# Altium project lab1_chernov_usb_i2c.PrjPcb
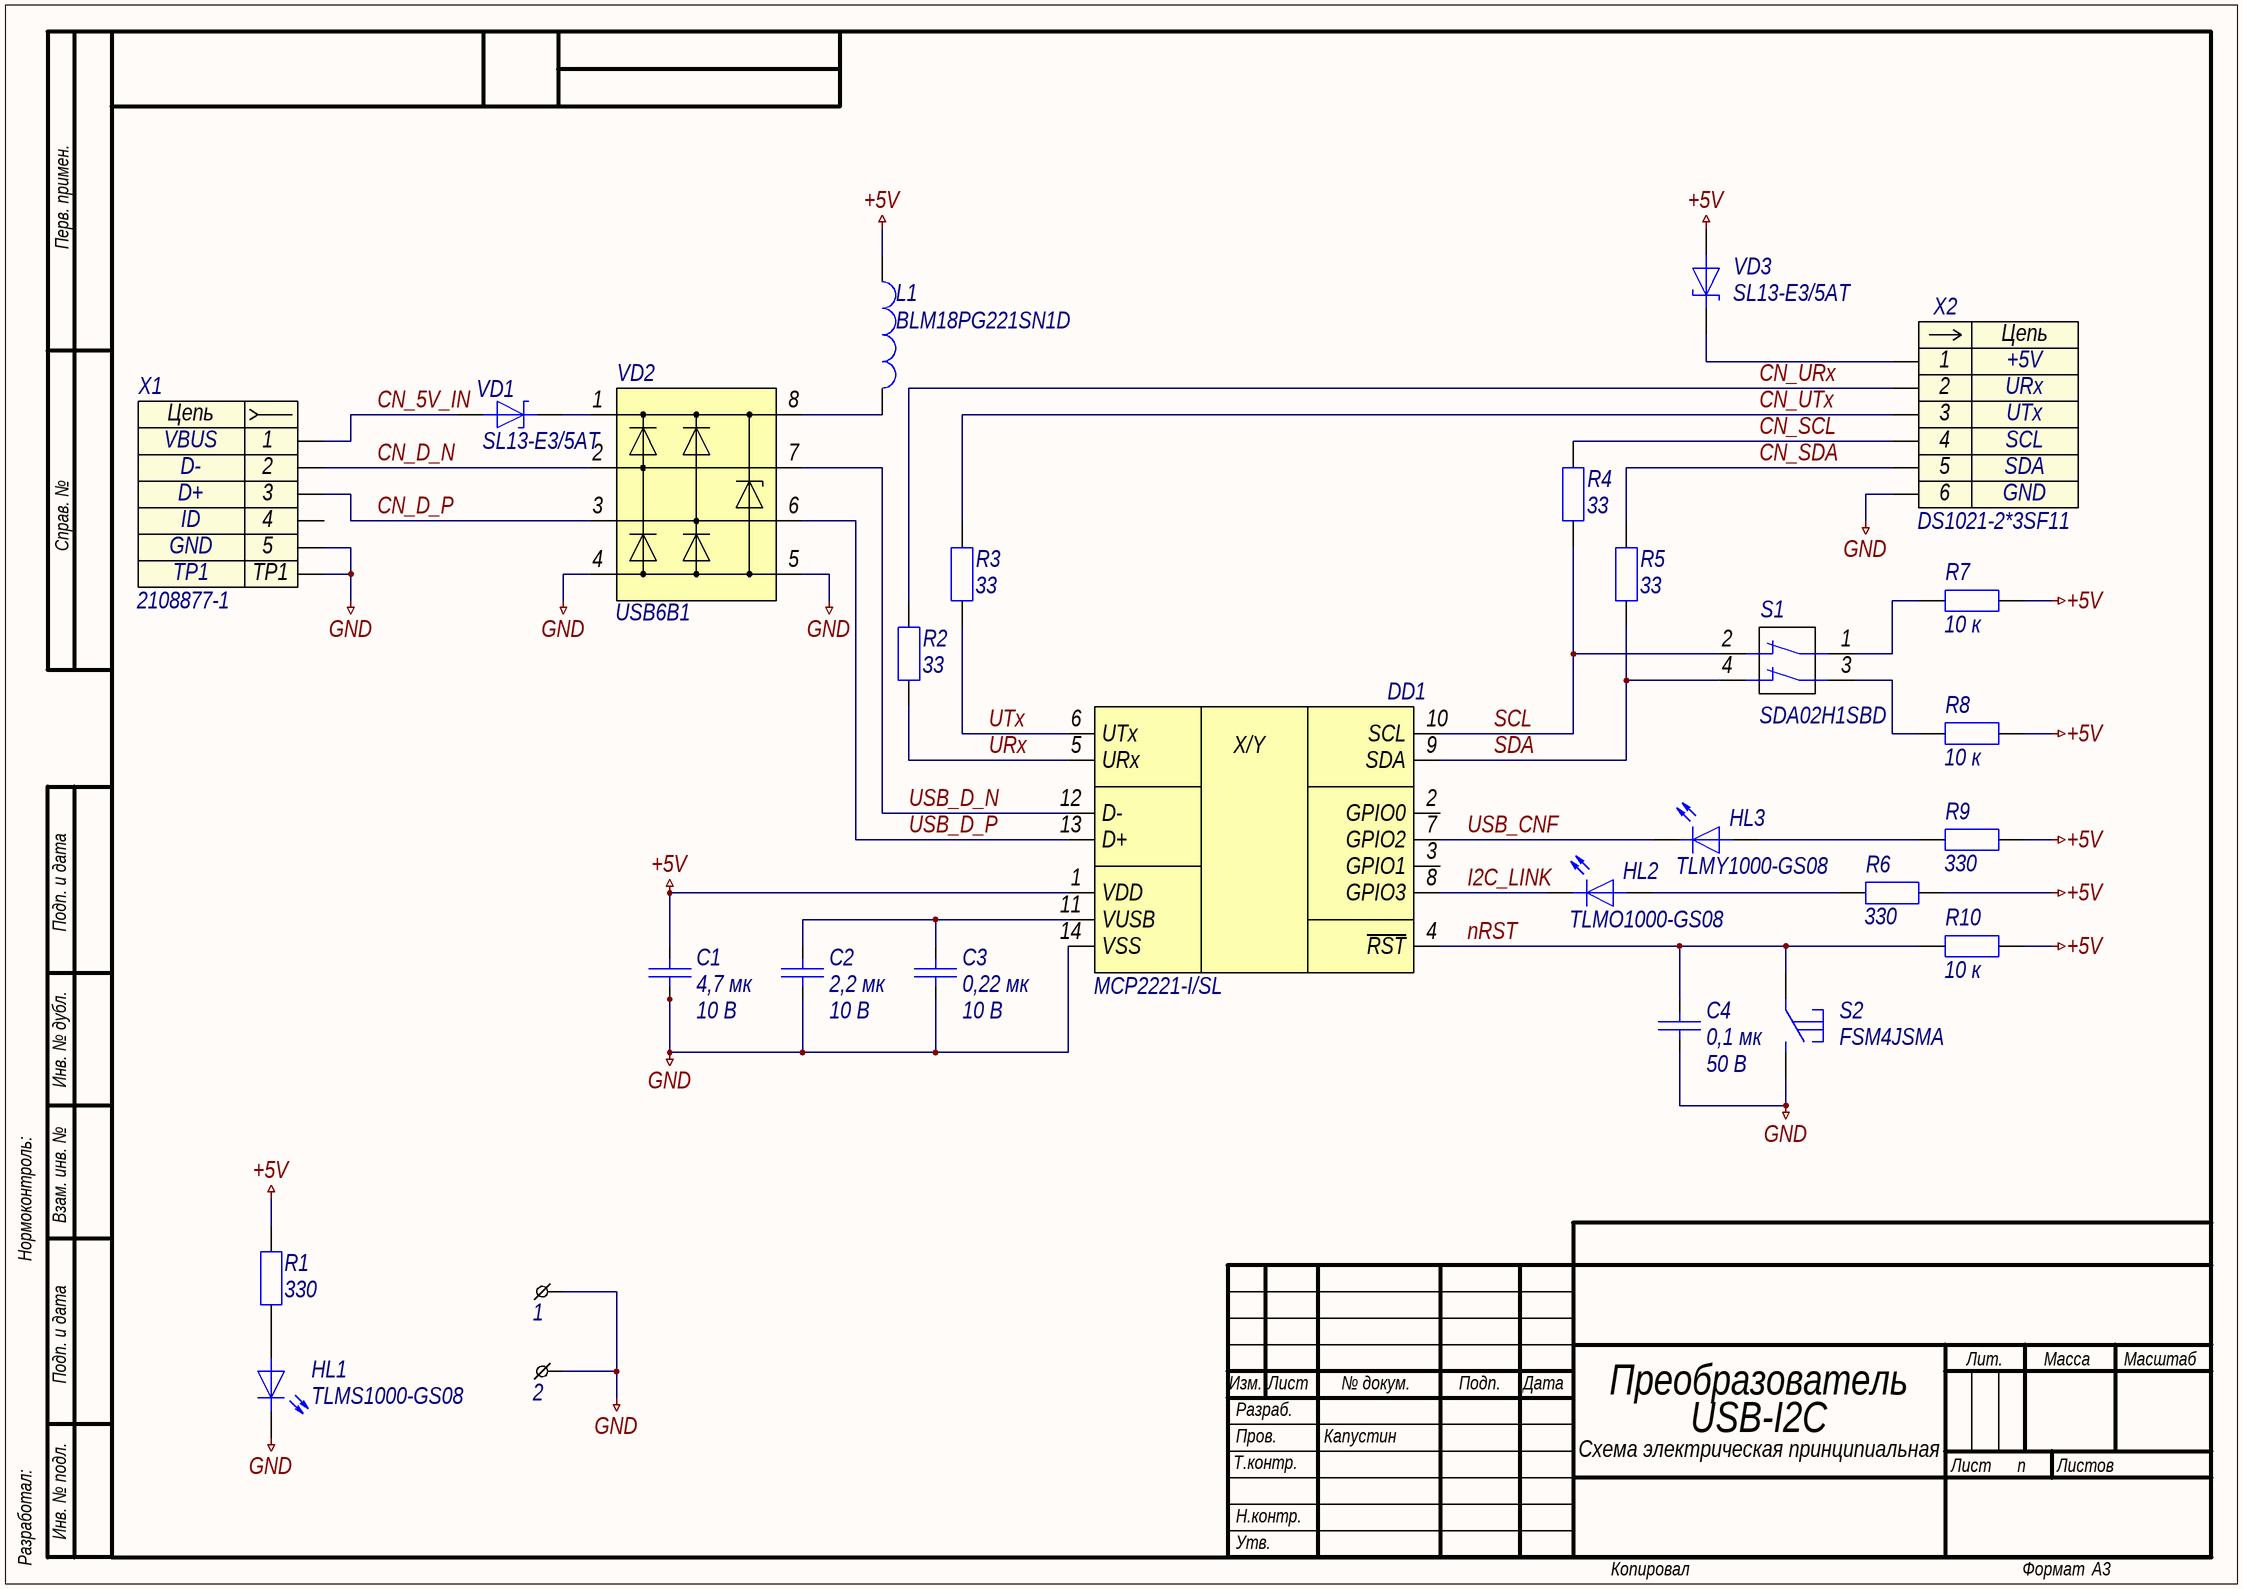
[diagram p0: lab1_chernov_usb_i2c.SchDoc]
approver: Капустин; check: Капустин; designation: СПБПУ.3331506.025; developer: Чернов; document_code: Ý3; document_type: Схема электрическая принципиальная; pcb_dec_number: СПБПУ.3331506.025; project: Лабораторная работа №1; title: Преобразователь USB-I2C; title_line_1: Преобразователь; title_line_2: USB-I2C
2 sheets, 28 parts. Net scope: global (net labels, ports and power ports of the same name join across sheets).
Board file: lab1_chernov_usb_i2c.PcbDoc
Sheets:
  lab1_chernov_usb_i2c.SchDoc
  usb_i2c_preferences.SchDoc

## Sheet lab1_chernov_usb_i2c.SchDoc: Преобразователь USB-I2C
size 420 x 297 mm; ApprovedBy: Капустин; CheckedBy: Капустин; DrawnBy: Чернов; DocumentNumber: СПБПУ.3331506.025Ý3; SheetNumber: n; DocumentCode: Ý3; ImagePath: СПБПУ.3331506.025

### Parts
1  MOUNTING_HOLE  [HOLE_1,6X3,3]  (value not drawn)
2  MOUNTING_HOLE  [HOLE_1,6X3,3]  (value not drawn)
C1  4,7 мк  Напряжение: 10 В  [C0603]
C2  2,2 мк  Напряжение: 10 В  [C0603]
C3  0,22 мк  Напряжение: 10 В  [C0603]
C4  0,1 мк  Напряжение: 50 В  [C0603]
DD1  MCP2221-I/SL  [SOIC127P600X175-14N]
HL1  TLMS1000-GS08  [HL0603]
HL2  TLMO1000-GS08  [HL0603]
HL3  TLMY1000-GS08  [HL0603]
L1  BLM18PG221SN1D  [BLM-2-0603]
R1  330  [R0603]
R2  33  [R0603]
R3  33  [R0603]
R4  33  [R0603]
R5  33  [R0603]
R6  330  [R0603]
R7  10 к  [R0603]
R8  10 к  [R0603]
R9  330  [R0603]
R10  10 к  [R0603]
S1  SDA02H1SBD  [DIP-SWITCH-02-706X930X545]
S2  FSM4JSMA  [FSM4JSMA]
VD1  SL13-E3/5AT  [DO-214AC]
VD2  USB6B1  [SO-8]
VD3  SL13-E3/5AT  [DO-214AC]
X1  2108877-1  [2108877-1]
X2  DS1021-2*3SF11  [DS1021-2X3SF11]

### Nets
+5V: C1.2 DD1.1(VDD) L1.1 R1.1 R6.2 R7.2 R8.2 R9.2 R10.2 VD3.2
GND: 1.1 2.1 C1.1 C2.1 C3.1 C4.1 DD1.14(VSS) HL1.1 S2.2 VD2.4 VD2.5 X1.5 X1.TP1 X2.6
CN_5V_IN: VD1.2 X1.1
CN_D_N: VD2.2 X1.2
CN_D_P: VD2.3 X1.3
CN_SCL: R4.1 X2.4
CN_SDA: R5.1 X2.5
CN_URx: R2.1 X2.2
CN_UTx: R3.1 X2.3
I2C_LINK: DD1.8(GPIO3) HL2.1
nRST: C4.2 DD1.4(~{RST}) R10.1 S2.1
SCL: DD1.10(SCL) R4.2 S1.2
SDA: DD1.9(SDA) R5.2 S1.4
URx: DD1.5(URx) R2.2
USB_CNF: DD1.7(GPIO2) HL3.1
USB_D_N: DD1.12(D-) VD2.7
USB_D_P: DD1.13(D+) VD2.6
UTx: DD1.6(UTx) R3.2
NetC2_2: C2.2 C3.2 DD1.11(VUSB)
NetHL1_2: HL1.2 R1.2
NetHL2_2: HL2.2 R6.1
NetHL3_2: HL3.2 R9.1
NetL1_2: L1.2 VD2.8
NetR7_1: R7.1 S1.1
NetR8_1: R8.1 S1.3
NetVD1_1: VD1.1 VD2.1
NetVD3_1: VD3.1 X2.1

Not connected (* = marked no-connect by the designer): DD1 2(GPIO0) 3(GPIO1); X1 4

### Notes on the sheet
- Перв. примен.
- Справ. №
- Подп. и дата
- Инв. № дубл.
- Нормоконтроль:
- Взам. инв. №
- Изм.
- Лист
- № докум.
- Подп.
- Дата
- Лит.
- Масса
- Масштаб
- Т.контр.
- Пров.
- Разраб.
- Листов
- Разработал:
- Инв. № подл.
- Н.контр.
- Утв.
- Копировал
- Формат
- А3
- (in symbol MCP2221-I/SL) X/Y
- (in symbol x0001) Цепь
- (in symbol x0003) Цепь

### Library data of the parts
1 2 = Отверстие 1,6x3,3: id: fstn0011; Описание: Отверстие под М1,5; Диаметр отверстия: 1,6 мм; Параметры металлизации: 3,3 мм; Наименование: Отверстие 1,6x3,3
C1 = c0012: =Описание; ID: c0012; Фамилия: Чернов; Описание: Конденсатор чип 0603 4,7 мкФ 10 В ±10 %; Наименование: CC0603KRX5R6BB475; Производитель: Yageo; Отклонение: ±10 %; Рабочие температуры: от -55 °С до +85 °С; Корпус: 0603; Номинал: 4,7 мк; Номинальное напряжение: 10 В; HelpURL: https://www.yageo.com/upload/media/product/productsearch/datasheet/mlcc/UPY-GPHC_X5R_4V-to-50V_26.pdf
C2 = c0009: =Описание; ID: c0009; Фамилия: Чернов; Описание: Конденсатор чип 0603 2,2 мкФ 10 В ±10 %; Наименование: CC0603KRX7R6BB225; Производитель: Yageo; Отклонение: ±10 %; Рабочие температуры: от -55 °С до +125 °С; Корпус: 0603; Номинал: 2,2 мк; Номинальное напряжение: 10 В; HelpURL: https://www.yageo.com/upload/media/product/productsearch/datasheet/mlcc/UPY-GPHC_X7R_6.3V-to-50V_20.pdf
C3 = c0006: =Описание; ID: c0006; Фамилия: Чернов; Описание: Конденсатор чип 0603 0,22 мкФ 10 В ±5 %; Наименование: CC0603JRX7R6BB224; Производитель: Yageo; Отклонение: ±5 %; Рабочие температуры: от -55 °С до +125 °С; Корпус: 0603; Номинал: 0,22 мк; Номинальное напряжение: 10 В; HelpURL: https://www.yageo.com/upload/media/product/productsearch/datasheet/mlcc/UPY-GPHC_X7R_6.3V-to-50V_20.pdf
C4 = c0005: =Описание; ID: c0005; Фамилия: Ларионов; Описание: Конденсатор чип 0603 0,1 мкФ 50 В ±5 %; Наименование: CC0603JRX7R9BB104; Производитель: Yageo; Отклонение: ±5 %; Рабочие температуры: от -55 °С до +125 °С; Корпус: 0603; Номинал: 0,1 мк; Номинальное напряжение: 50 В; HelpURL: https://www.yageo.com/upload/media/product/products/datasheet/mlcc/UPY-GPHC_X7R_6.3V-to-50V_20.pdf
HL1 = hl0001: =Описание; ID: hl0001; Фамилия: Ларионов; Описание: Светодиод чип 0603 красный; Производитель: Vishay Intertechnology, Inc.; Цвет: Red; Номинальная сила света: 4 мкд; Номинальная длина волны: 628 нм; Номинальный прямой ток: 15 мА; Номинальное падение напряжения: 1,8 В; Рассеиваемая мощность: 40 мВт; Рабочие температуры: от -40 °С до +100 °С; Корпус: 0603; Наименование: TLMS1000-GS08; HelpURL: https://www.vishay.com/leds/list/product-83172/
HL2 = hl0002: =Описание; ID: hl0002; Фамилия: Ларионов; Описание: Светодиод чип 0603 светло-оранжевый; Производитель: Vishay Intertechnology, Inc.; Цвет: Soft orange; Номинальная сила света: 7,5 мкд; Номинальная длина волны: 605 нм; Номинальный прямой ток: 15 мА; Номинальное падение напряжения: 1,8 В; Рассеиваемая мощность: 40 мВт; Рабочие температуры: от -40 °С до +100 °С; Корпус: 0603; Наименование: TLMO1000-GS08; HelpURL: https://www.vishay.com/leds/list/product-83172/
HL3 = hl0003: =Описание; ID: hl0003; Фамилия: Ларионов; Описание: Светодиод чип 0603 желтый; Производитель: Vishay Intertechnology, Inc.; Цвет: Yellow; Номинальная сила света: 7,5 мкд; Номинальная длина волны: 588 нм; Номинальный прямой ток: 15 мА; Номинальное падение напряжения: 1,8 В; Рассеиваемая мощность: 40 мВт; Рабочие температуры: от -40 °С до +100 °С; Корпус: 0603; Наименование: TLMY1000-GS08; HelpURL: https://www.vishay.com/leds/list/product-83172/
L1 = l0002: =Описание; ID: l0002; Фамилия: Самарин; Описание: Ферритовая бусина 220 Ом ±25 %; Производитель: Murata Manufacturing Co., Ltd.; Сопротивление, 100 МГц: 220 Ом; Отклонение, 100 Мгц: ±25 %; Сопротивление при постоянном токе: 0,1 Ом; Рабочие температуры: от -55 °С до +125 °С; Корпус: 0603; Наименование: BLM18PG221SN1D; HelpURL: https://www.murata.com/en-global/products/productdetail?partno=BLM18PG221SN1%23
R1 R6 R9 = r0009: =Описание; ID: r0009; Фамилия: Ларионов; Описание: Резистор чип 0603 330 Ом ±1 % 0,1 Вт; Наименование: RC0603FR-07330RL; Производитель: Yageo; Отклонение: ±1 %; Номинальное напряжение: 75 В; Рабочие температуры: от -55 °С до +155 °С; Номинальный ток: 1 А; Корпус: 0603; Номинал: 330; HelpURL: https://www.yageo.com/upload/media/product/productsearch/datasheet/rchip/PYu-RC_Group_51_RoHS_L_11.pdf
R2-R5 = r0005: =Описание; ID: r0005; Фамилия: Козлов; Описание: Резистор чип 0603 33 Ом ±1 % 0,1 Вт; Наименование: AA0603FR-0733RL; Производитель: Yageo; Отклонение: ±1 %; Номинальное напряжение: 75 В; Рабочие температуры: от -55 °С до +155 °С; Номинальный ток: 1 А; Корпус: 0603; Номинал: 33; HelpURL: https://www.yageo.com/upload/media/product/productsearch/datasheet/rchip/PYu-AA_51_RoHS_L_3.pdf
R7 R8 R10 = r0012: =Описание; ID: r0012; Фамилия: Самарин; Описание: Резистор чип 0603 10 кОм ±1 % 0,1 Вт; Наименование: RC0603FR-0710KL; Производитель: Yageo; Отклонение: ±1 %; Номинальное напряжение: 75 В; Рабочие температуры: от -55 °С до +155 °С; Номинальный ток: 1 А; Корпус: 0603; Номинал: 10 к; HelpURL: https://www.yageo.com/upload/media/product/productsearch/datasheet/rchip/PYu-RC_Group_51_RoHS_L_11.pdf
S1 = sw0001: =Описание; ID: sw0001; Фамилия: Козлов; Описание: 2-х позиционный движковый переключатель; Производитель: C&K; Ток нагрузки: 100 мА @ 5 В; Сопротивление контакта: 50 мОм; Количество контактов: 2; Рабочие температуры: от -40 °С до +85 °С; Промывка: Разрешена; Корпус: 7,06х9,30х5,45; Наименование: SDA02H1SBD; HelpURL: https://www.ckswitches.com/products/switches/product-details/DIP/SDA/SDA02H1SBD/
S2 = sw0002: =Описание; ID: sw0002; Фамилия: Паньков; Описание: Тактовая кнопка поверхностного монтажа; Производитель: TE Connectivity; Ток нагрузки: 50 мА @ 24 В; Сопротивление контакта: 100 мОм; Количество контактов: 1; Рабочие температуры: от –35 °С до +85 °С; Промывка: Разрешена; Корпус: 6,00x6,00x4,98; Наименование: FSM4JSMA; HelpURL: https://www.te.com/usa-en/product-4-1437565-1.html
VD1 VD3 = vd0001: =Описание; ID: vd0001; Фамилия: Ларионов; Описание: Диод Шоттки 30 В 1,5 А; Производитель: Vishay Intertechnology, Inc.; Пиковое прямое напряжение: 0,445 В; Импульсное обратное напряжение: 30 В; Макс допустимый средний прямой ток: 1,5 А; Рабочие температуры: от -55 °С до +125 °С; Наименование: SL13-E3/5AT; Корпус: DO-214AC; HelpURL: https://www.vishay.com/product?docid=88740
VD2 = vd0005: =Описание; ID: vd0005; Фамилия: Ларионов; Описание: Диодная сборка для подавления помех, от 6 В; Производитель: STMicroelectronics; Наименование: USB6B1; Корпус: SO-8; HelpURL: https://www.st.com/content/st_com/en/products/protection-devices/esd-protection/usb-port-protection/usb6b1.html
X1 = x0001: =Описание; Contact_1: VBUS; Contact_2: D-; Contact_3: D+; Contact_4: ID; Contact_5: GND; ID: x0001; Фамилия: Ларионов; Описание: Micro USB Type B IP68 гнездо; Производитель: TE Connectivity; Наименование: 2108877-1; HelpURL: https://www.te.com/global-en/product-2108877-1.html
X2 = x0003: =Описание; Contact_1: +5V; Contact_2: URx; Contact_3: UTx; Contact_4: SCL; Contact_5: SDA; Contact_6: GND; ID: x0003; Фамилия: Самарин; Описание: PLS 3x2 pin 2,54 мм вилка прямой; Производитель: Connfly Electronic Co. LTD; Наименование: DS1021-2*3SF11; HelpURL: http://www.connfly.com/productshow.aspx?id=118

## Sheet usb_i2c_preferences.SchDoc: Преобразователь USB-I2C
size 209 x 297 mm; ApprovedBy: Капустин; CheckedBy: Капустин; DrawnBy: Чернов; DocumentNumber: СПБПУ.3331506.025Ý3; SheetNumber: n; DocumentCode: Ý3; ImagePath: СПБПУ.3331506.025
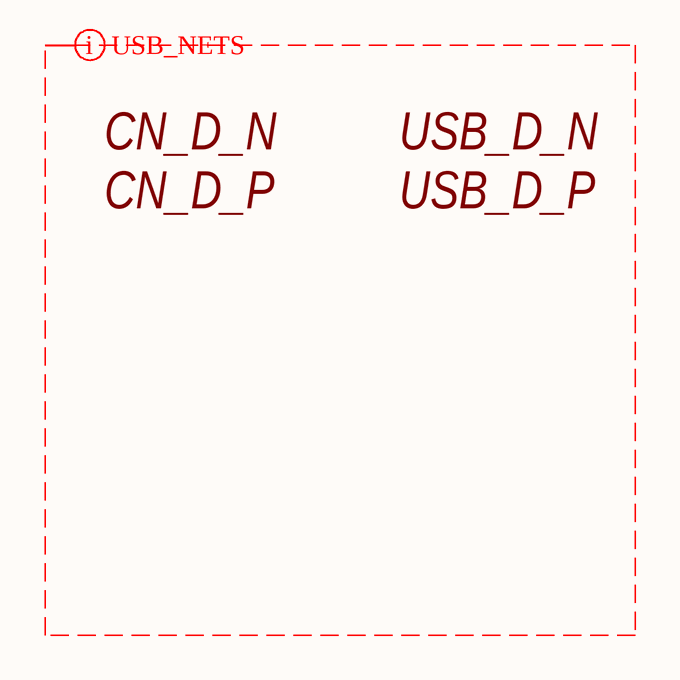
[diagram p1: usb_i2c_preferences.SchDoc]

### Layout directives
differential pair; rule Differential Pairs Routing [Pref Gap = 0.254mm    Min Gap  = 0.15mm    Max Gap  = 0.254mmPref Width = 0.381mm    Min Width  = 0.155mm    Max Width  = 0.381mm]; differential pair class USB_SIGNAL: CN_D_N, CN_D_P, USB_D_N, USB_D_P

### Notes on the sheet
- Labels drawn without touching a wire or pin: CN_D_N, CN_D_P, USB_D_N, USB_D_P
- Подп. и дата
- Инв. № дубл.
- Взам. инв. №
- Инв. № подл.
- Лист
- Изм.
- № докум.
- Подп.
- Дата
- Копировал
- Формат
- А4